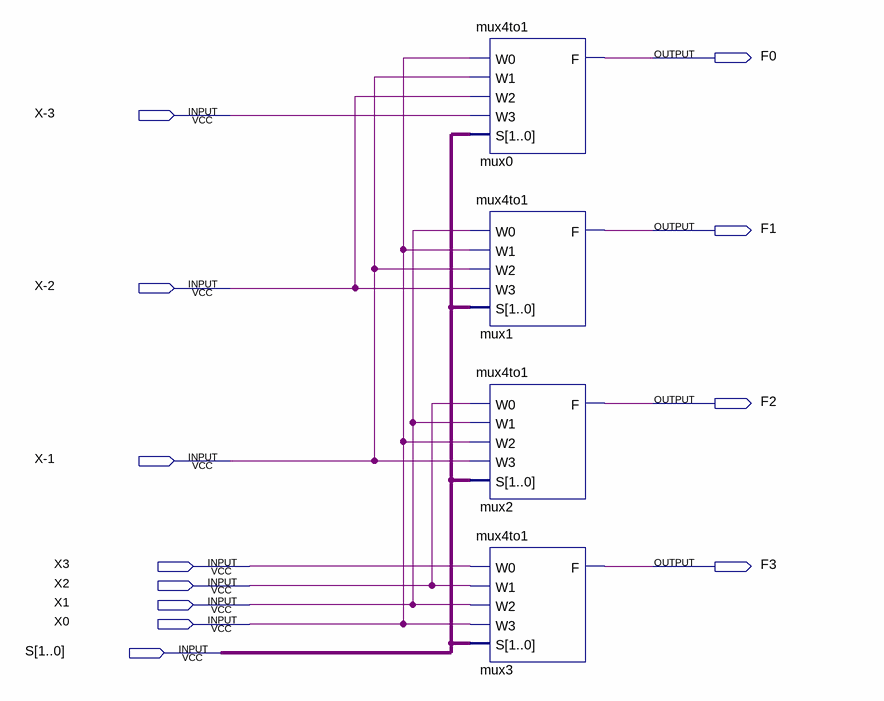
[diagram p0: schematic sheet]
// Quartus schematic lab8step2.bdf as structural Verilog: 4 symbols, 12 pins
module lab8step2 (
  input  \X-3 ,
  input  \X-2 ,
  input  \X-1 ,
  input  X3,
  input  X2,
  input  X1,
  input  X0,
  input  [1:0] S,
  output F0,
  output F1,
  output F2,
  output F3
);

  mux4to1 mux0 (.W0(X0), .W1(\X-1 ), .W2(\X-2 ), .W3(\X-3 ), .S(S), .F(F0));
  mux4to1 mux1 (.W0(X1), .W1(X0), .W2(\X-1 ), .W3(\X-2 ), .S(S), .F(F1));
  mux4to1 mux2 (.W0(X2), .W1(X1), .W2(X0), .W3(\X-1 ), .S(S), .F(F2));
  mux4to1 mux3 (.W0(X3), .W1(X2), .W2(X1), .W3(X0), .S(S), .F(F3));
endmodule
